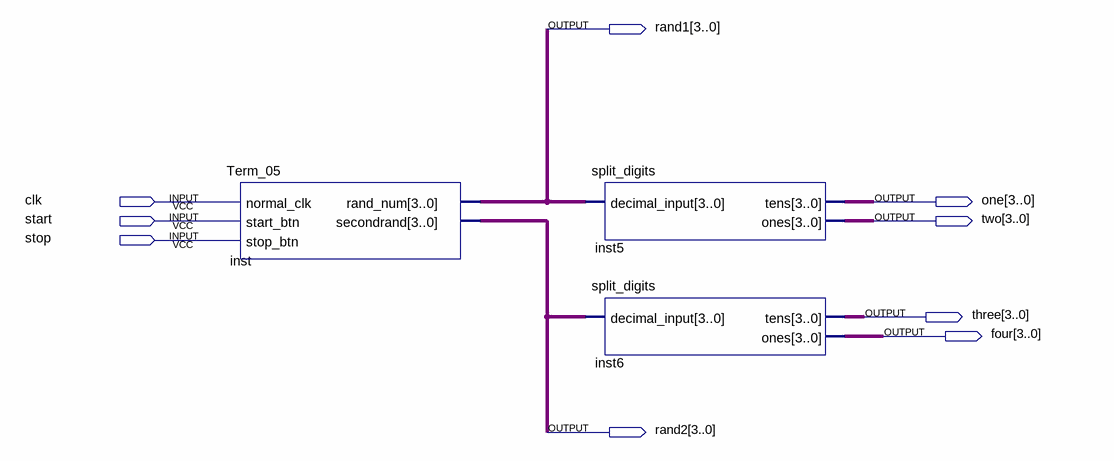
[diagram p0: schematic sheet]
// Quartus schematic split_into_two.bdf as structural Verilog: 3 symbols, 9 pins
module split_into_two (
  input  clk,
  input  start,
  input  stop,
  output [3:0] rand1,
  output [3:0] one,
  output [3:0] two,
  output [3:0] three,
  output [3:0] four,
  output [3:0] rand2
);

  Term_05 inst (.normal_clk(clk), .start_btn(start), .stop_btn(stop), .rand_num(rand1), .secondrand(rand2));
  split_digits inst5 (.decimal_input(rand1), .tens(one), .ones(two));
  split_digits inst6 (.decimal_input(rand2), .tens(three), .ones(four));
endmodule
